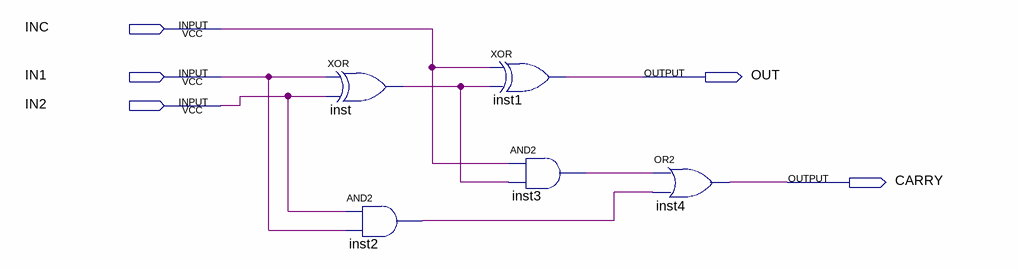
[diagram p0: schematic sheet]
// Quartus schematic sdProjectSomadorCompleto.bdf as structural Verilog: 5 symbols, 5 pins
module sdProjectSomadorCompleto (
  input  INC,
  input  IN1,
  input  IN2,
  output OUT,
  output CARRY
);

  wire inst2_out, inst3_out, inst_out;

  xor inst (inst_out, IN1, IN2);
  and inst2 (inst2_out, IN2, IN1);
  xor inst1 (OUT, INC, inst_out);
  and inst3 (inst3_out, INC, inst_out);
  or inst4 (CARRY, inst3_out, inst2_out);
endmodule
